# Altium schematic sheet Ethernet_Switch.SchDoc: =project_title
size Tabloid; CompanyName: Luxonis Holding; DrawnBy: Dan Dunga; Organization: Luxonis Holding; Address1: 1925 Harmony Park Drive; Address2: Westminster, CO; Address3: 80234; Address4: United States; SheetNumber: 7; SheetTotal: 16
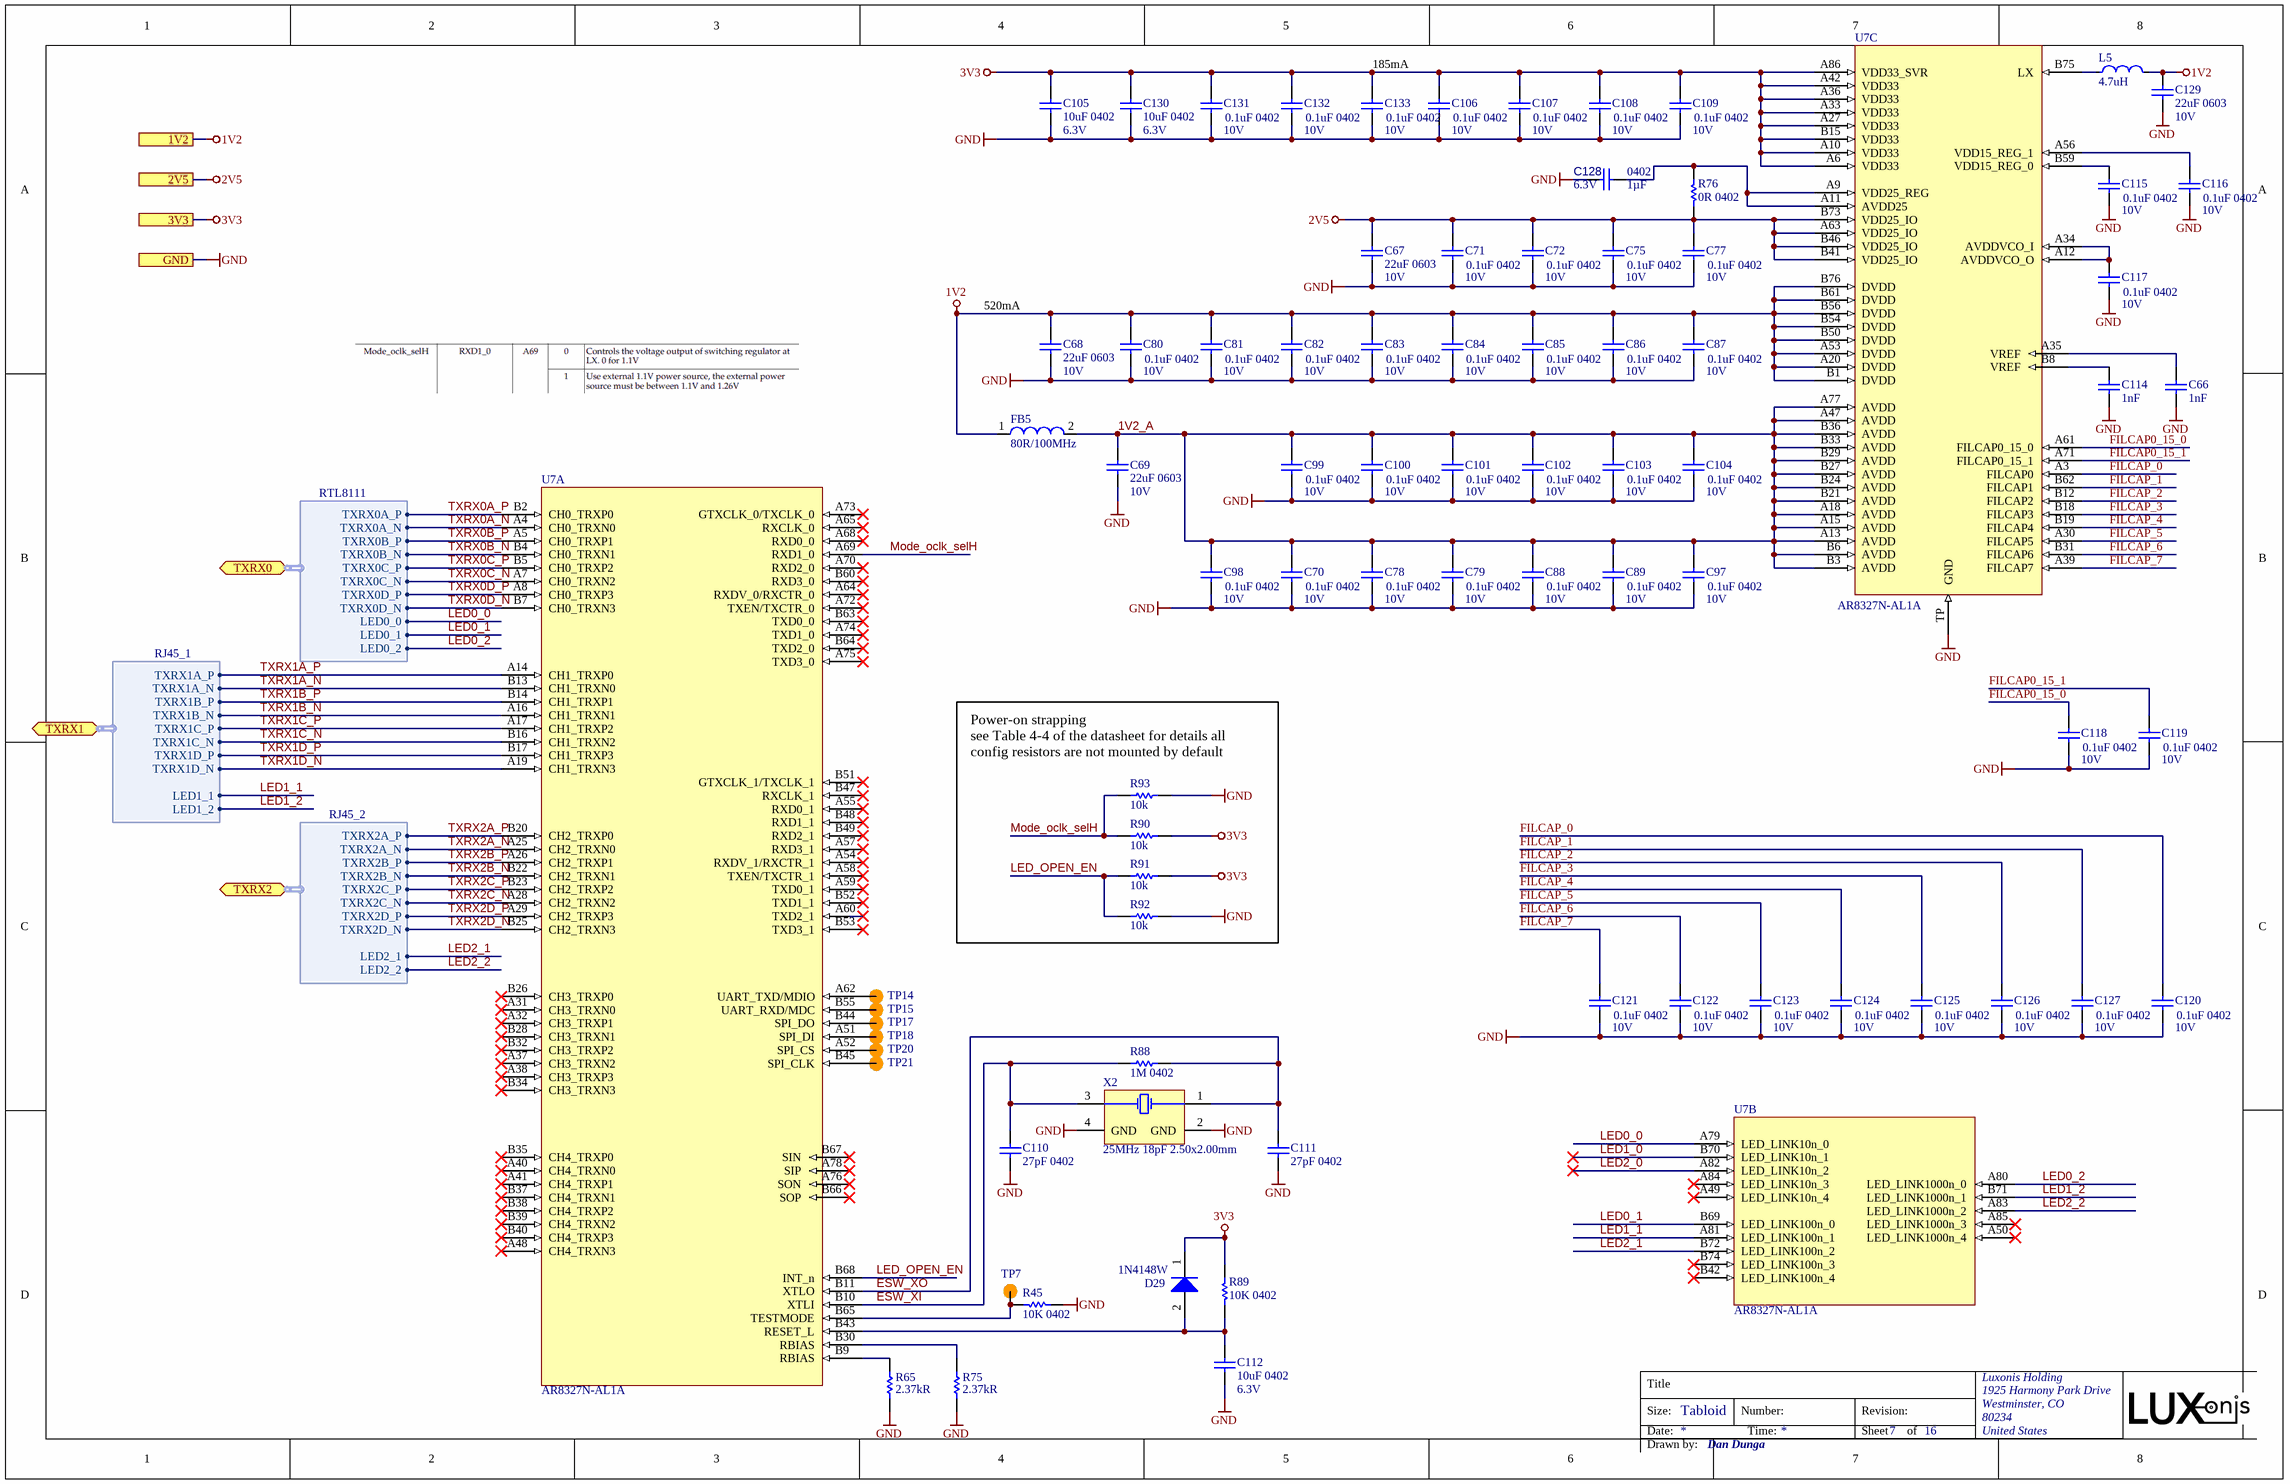
[diagram p0: Ethernet_Switch.SchDoc]

## Parts
C66  value 1nF  [FP-GRM155-0_05-IPC_B]  (hidden comment: GRM1555C1H102JA01D)
C67  22uF 0603  Voltage Rating: 10V  [CAPC0603(1608)100_N]
C68  22uF 0603  Voltage Rating: 10V  [CAPC0603(1608)100_N]
C69  22uF 0603  Voltage Rating: 10V  [CAPC0603(1608)100_N]
C70  0.1uF 0402  Voltage Rating: 10V  [CAPC0402(1005)70_N]
C71  0.1uF 0402  Voltage Rating: 10V  [CAPC0402(1005)70_N]
C72  0.1uF 0402  Voltage Rating: 10V  [CAPC0402(1005)70_N]
C75  0.1uF 0402  Voltage Rating: 10V  [CAPC0402(1005)70_N]
C77  0.1uF 0402  Voltage Rating: 10V  [CAPC0402(1005)70_N]
C78  0.1uF 0402  Voltage Rating: 10V  [CAPC0402(1005)70_N]
C79  0.1uF 0402  Voltage Rating: 10V  [CAPC0402(1005)70_N]
C80  0.1uF 0402  Voltage Rating: 10V  [CAPC0402(1005)70_N]
C81  0.1uF 0402  Voltage Rating: 10V  [CAPC0402(1005)70_N]
C82  0.1uF 0402  Voltage Rating: 10V  [CAPC0402(1005)70_N]
C83  0.1uF 0402  Voltage Rating: 10V  [CAPC0402(1005)70_N]
C84  0.1uF 0402  Voltage Rating: 10V  [CAPC0402(1005)70_N]
C85  0.1uF 0402  Voltage Rating: 10V  [CAPC0402(1005)70_N]
C86  0.1uF 0402  Voltage Rating: 10V  [CAPC0402(1005)70_N]
C87  0.1uF 0402  Voltage Rating: 10V  [CAPC0402(1005)70_N]
C88  0.1uF 0402  Voltage Rating: 10V  [CAPC0402(1005)70_N]
C89  0.1uF 0402  Voltage Rating: 10V  [CAPC0402(1005)70_N]
C97  0.1uF 0402  Voltage Rating: 10V  [CAPC0402(1005)70_N]
C98  0.1uF 0402  Voltage Rating: 10V  [CAPC0402(1005)70_N]
C99  0.1uF 0402  Voltage Rating: 10V  [CAPC0402(1005)70_N]
C100  0.1uF 0402  Voltage Rating: 10V  [CAPC0402(1005)70_N]
C101  0.1uF 0402  Voltage Rating: 10V  [CAPC0402(1005)70_N]
C102  0.1uF 0402  Voltage Rating: 10V  [CAPC0402(1005)70_N]
C103  0.1uF 0402  Voltage Rating: 10V  [CAPC0402(1005)70_N]
C104  0.1uF 0402  Voltage Rating: 10V  [CAPC0402(1005)70_N]
C105  10uF 0402  Voltage Rating: 6.3V  [CAPC0402(1005)70_N]
C106  0.1uF 0402  Voltage Rating: 10V  [CAPC0402(1005)70_N]
C107  0.1uF 0402  Voltage Rating: 10V  [CAPC0402(1005)70_N]
C108  0.1uF 0402  Voltage Rating: 10V  [CAPC0402(1005)70_N]
C109  0.1uF 0402  Voltage Rating: 10V  [CAPC0402(1005)70_N]
C110  27pF 0402  [CAPC0402(1005)60_N]
C111  27pF 0402  [CAPC0402(1005)60_N]
C112  10uF 0402  Voltage Rating: 6.3V  [CAPC0402(1005)70_N]
C114  value 1nF  [FP-GRM155-0_05-IPC_B]  (hidden comment: GRM1555C1H102JA01D)
C115  0.1uF 0402  Voltage Rating: 10V  [CAPC0402(1005)70_N]
C116  0.1uF 0402  Voltage Rating: 10V  [CAPC0402(1005)70_N]
C117  0.1uF 0402  Voltage Rating: 10V  [CAPC0402(1005)70_N]
C118  0.1uF 0402  Voltage Rating: 10V  [CAPC0402(1005)70_N]
C119  0.1uF 0402  Voltage Rating: 10V  [CAPC0402(1005)70_N]
C120  0.1uF 0402  Voltage Rating: 10V  [CAPC0402(1005)70_N]
C121  0.1uF 0402  Voltage Rating: 10V  [CAPC0402(1005)70_N]
C122  0.1uF 0402  Voltage Rating: 10V  [CAPC0402(1005)70_N]
C123  0.1uF 0402  Voltage Rating: 10V  [CAPC0402(1005)70_N]
C124  0.1uF 0402  Voltage Rating: 10V  [CAPC0402(1005)70_N]
C125  0.1uF 0402  Voltage Rating: 10V  [CAPC0402(1005)70_N]
C126  0.1uF 0402  Voltage Rating: 10V  [CAPC0402(1005)70_N]
C127  0.1uF 0402  Voltage Rating: 10V  [CAPC0402(1005)70_N]
C128  value 1µF  Case/Package: 0402  Voltage Rating: 6.3V  [CAPC1005X55X25LL05T10]  (hidden comment: 04026D105KAT2A)
C129  22uF 0603  Voltage Rating: 10V  [CAPC0603(1608)100_N]
C130  10uF 0402  Voltage Rating: 6.3V  [CAPC0402(1005)70_N]
C131  0.1uF 0402  Voltage Rating: 10V  [CAPC0402(1005)70_N]
C132  0.1uF 0402  Voltage Rating: 10V  [CAPC0402(1005)70_N]
C133  0.1uF 0402  Voltage Rating: 10V  [CAPC0402(1005)70_N]
D29  1N4148W  [1N4148W-7-F]
FB5  80R/100MHz  [BK1608HS800-T_N]
L5  Inductance: 4.7uH  [FP-DFE252012C-IPC_C]  (hidden comment: DFE252012P-4R7M=P2)
R45  10K 0402  [RESC0402(1005)_N]
R65  Resistance: 2.37kR  [RESC1005X40X25NL05T05]  (hidden comment: ERJ-2RKF2371X)
R75  Resistance: 2.37kR  [RESC1005X40X25NL05T05]  (hidden comment: ERJ-2RKF2371X)
R76  0R 0402  [RESC0402(1005)_N]
R88  1M 0402  [RESC0402(1005)_N]
R89  10K 0402  [RESC0402(1005)_N]
R90  value 10k  [RESC0402(1005)_N]  (hidden comment: RC0402FR-1310KL)
R91  value 10k  [RESC0402(1005)_N]  (hidden comment: RC0402FR-1310KL)
R92  value 10k  [RESC0402(1005)_N]  (hidden comment: RC0402FR-1310KL)
R93  value 10k  [RESC0402(1005)_N]  (hidden comment: RC0402FR-1310KL)
TP7  TP075_150_NS  [TP075_150_NS]  (value not drawn)  (no BOM)
TP14  TP075_150_NS  [TP075_150_NS]  (value not drawn)  (no BOM)
TP15  TP075_150_NS  [TP075_150_NS]  (value not drawn)  (no BOM)
TP17  TP075_150_NS  [TP075_150_NS]  (value not drawn)  (no BOM)
TP18  TP075_150_NS  [TP075_150_NS]  (value not drawn)  (no BOM)
TP20  TP075_150_NS  [TP075_150_NS]  (value not drawn)  (no BOM)
TP21  TP075_150_NS  [TP075_150_NS]  (value not drawn)  (no BOM)
U7  AR8327N-AL1A  [AR8327N-AL1A]  (parts A,B,C of 3)
X2  25MHz 18pF 2.50x2.00mm  [ECS-250-18-36B-CKY-TR]

## Ports
1V2, 2V5, 3V3, GND, TXRX0 (bidir, harness RTL8111), TXRX1 (bidir, harness RJ45_1), TXRX2 (bidir, harness RJ45_2)

## Harnesses
RTL8111: TXRX0A_P, TXRX0A_N, TXRX0B_P, TXRX0B_N, TXRX0C_P, TXRX0C_N, TXRX0D_P, TXRX0D_N, LED0_0, LED0_1, LED0_2
RJ45_1: TXRX1A_P, TXRX1A_N, TXRX1B_P, TXRX1B_N, TXRX1C_P, TXRX1C_N, TXRX1D_P, TXRX1D_N, LED1_1, LED1_2
RJ45_2: TXRX2A_P, TXRX2A_N, TXRX2B_P, TXRX2B_N, TXRX2C_P, TXRX2C_N, TXRX2D_P, TXRX2D_N, LED2_1, LED2_2

## Nets
1V2: C68.2 C80.2 C81.2 C82.2 C83.2 C84.2 C85.2 C86.2 C87.2 C129.2 FB5.1 L5.2 U7.A20(DVDD) U7.A53(DVDD) U7.B1(DVDD) U7.B50(DVDD) U7.B54(DVDD) U7.B56(DVDD) U7.B61(DVDD) U7.B76(DVDD) ; port 1V2
2V5: C67.2 C71.2 C72.2 C75.2 C77.2 R76.1 U7.A63(VDD25_IO) U7.B41(VDD25_IO) U7.B46(VDD25_IO) U7.B73(VDD25_IO) ; port 2V5
3V3: C105.2 C106.2 C107.2 C108.2 C109.2 C130.2 C131.2 C132.2 C133.2 D29.1(K) R89.1 R90.2 R91.2 U7.A6(VDD33) U7.A10(VDD33) U7.A27(VDD33) U7.A33(VDD33) U7.A36(VDD33) U7.A42(VDD33) U7.A86(VDD33_SVR) U7.B15(VDD33) ; port 3V3
GND: C66.1 C67.1 C68.1 C69.1 C70.1 C71.1 C72.1 C75.1 C77.1 C78.1 C79.1 C80.1 C81.1 C82.1 C83.1 C84.1 C85.1 C86.1 C87.1 C88.1 C89.1 C97.1 C98.1 C99.1 C100.1 C101.1 C102.1 C103.1 C104.1 C105.1 C106.1 C107.1 C108.1 C109.1 C110.1 C111.1 C112.1 C114.1 C115.1 C116.1 C117.1 C118.1 C119.1 C120.1 C121.1 C122.1 C123.1 C124.1 C125.1 C126.1 C127.1 C128.2 C129.1 C130.1 C131.1 C132.1 C133.1 R45.1 R65.1 R75.1 R92.2 R93.2 U7.TP(GND) X2.2(GND) X2.4(GND) ; port GND
1V2_A: C69.2 C70.2 C78.2 C79.2 C88.2 C89.2 C97.2 C98.2 C99.2 C100.2 C101.2 C102.2 C103.2 C104.2 FB5.2 U7.A13(AVDD) U7.A15(AVDD) U7.A18(AVDD) U7.A47(AVDD) U7.A77(AVDD) U7.B3(AVDD) U7.B6(AVDD) U7.B21(AVDD) U7.B24(AVDD) U7.B27(AVDD) U7.B29(AVDD) U7.B33(AVDD) U7.B36(AVDD)
ESW_XI: C110.2 R88.1 U7.B10(XTLI) X2.3(X2)
ESW_XO: C111.2 R88.2 U7.B11(XTLO) X2.1(X1)
FILCAP0_15_0: C118.2 U7.A61(FILCAP0_15_0)
FILCAP0_15_1: C119.2 U7.A71(FILCAP0_15_1)
FILCAP_0: C120.2 U7.A3(FILCAP0)
FILCAP_1: C127.2 U7.B62(FILCAP1)
FILCAP_2: C126.2 U7.B12(FILCAP2)
FILCAP_3: C125.2 U7.B18(FILCAP3)
FILCAP_4: C124.2 U7.B19(FILCAP4)
FILCAP_5: C123.2 U7.A30(FILCAP5)
FILCAP_6: C122.2 U7.B31(FILCAP6)
FILCAP_7: C121.2 U7.A39(FILCAP7)
LED0_0: U7.A79(LED_LINK10n_0) ; port TXRX0.LED0_0
LED0_1: U7.B69(LED_LINK100n_0) ; port TXRX0.LED0_1
LED0_2: U7.A80(LED_LINK1000n_0) ; port TXRX0.LED0_2
LED1_0: U7.B70(LED_LINK10n_1)
LED1_1: U7.A81(LED_LINK100n_1) ; port TXRX1.LED1_1
LED1_2: U7.B71(LED_LINK1000n_1) ; port TXRX1.LED1_2
LED2_0: U7.A82(LED_LINK10n_2)
LED2_1: U7.B72(LED_LINK100n_2) ; port TXRX2.LED2_1
LED2_2: U7.A83(LED_LINK1000n_2) ; port TXRX2.LED2_2
LED_OPEN_EN: R91.1 R92.1 U7.B68(INT_n)
Mode_oclk_selH: R90.1 R93.1 U7.A69(RXD1_0)
TXRX0A_N: U7.A4(CH0_TRXN0) ; port TXRX0.TXRX0A_N
TXRX0A_P: U7.B2(CH0_TRXP0) ; port TXRX0.TXRX0A_P
TXRX0B_N: U7.B4(CH0_TRXN1) ; port TXRX0.TXRX0B_N
TXRX0B_P: U7.A5(CH0_TRXP1) ; port TXRX0.TXRX0B_P
TXRX0C_N: U7.A7(CH0_TRXN2) ; port TXRX0.TXRX0C_N
TXRX0C_P: U7.B5(CH0_TRXP2) ; port TXRX0.TXRX0C_P
TXRX0D_N: U7.B7(CH0_TRXN3) ; port TXRX0.TXRX0D_N
TXRX0D_P: U7.A8(CH0_TRXP3) ; port TXRX0.TXRX0D_P
TXRX1A_N: U7.B13(CH1_TRXN0) ; port TXRX1.TXRX1A_N
TXRX1A_P: U7.A14(CH1_TRXP0) ; port TXRX1.TXRX1A_P
TXRX1B_N: U7.A16(CH1_TRXN1) ; port TXRX1.TXRX1B_N
TXRX1B_P: U7.B14(CH1_TRXP1) ; port TXRX1.TXRX1B_P
TXRX1C_N: U7.B16(CH1_TRXN2) ; port TXRX1.TXRX1C_N
TXRX1C_P: U7.A17(CH1_TRXP2) ; port TXRX1.TXRX1C_P
TXRX1D_N: U7.A19(CH1_TRXN3) ; port TXRX1.TXRX1D_N
TXRX1D_P: U7.B17(CH1_TRXP3) ; port TXRX1.TXRX1D_P
TXRX2A_N: U7.A25(CH2_TRXN0) ; port TXRX2.TXRX2A_N
TXRX2A_P: U7.B20(CH2_TRXP0) ; port TXRX2.TXRX2A_P
TXRX2B_N: U7.B22(CH2_TRXN1) ; port TXRX2.TXRX2B_N
TXRX2B_P: U7.A26(CH2_TRXP1) ; port TXRX2.TXRX2B_P
TXRX2C_N: U7.A28(CH2_TRXN2) ; port TXRX2.TXRX2C_N
TXRX2C_P: U7.B23(CH2_TRXP2) ; port TXRX2.TXRX2C_P
TXRX2D_N: U7.B25(CH2_TRXN3) ; port TXRX2.TXRX2D_N
TXRX2D_P: U7.A29(CH2_TRXP3) ; port TXRX2.TXRX2D_P
NetC66_2: C66.2 U7.A35(VREF)
NetC112_2: C112.2 D29.2(A) R89.2 U7.B43(RESET_L)
NetC114_2: C114.2 U7.B8(VREF)
NetC115_2: C115.2 U7.B59(VDD15_REG_0)
NetC116_2: C116.2 U7.A56(VDD15_REG_1)
NetC117_2: C117.2 U7.A12(AVDDVCO_O) U7.A34(AVDDVCO_I)
NetC128_1: C128.1 R76.2 U7.A9(VDD25_REG) U7.A11(AVDD25)
NetL5_1: L5.1 U7.B75(LX)
NetR45_2: R45.2 TP7.1 U7.B65(TESTMODE)
NetR65_2: R65.2 U7.B9(RBIAS)
NetR75_2: R75.2 U7.B30(RBIAS)
NetTP14_1: TP14.1 U7.A62(UART_TXD/MDIO)
NetTP15_1: TP15.1 U7.B55(UART_RXD/MDC)
NetTP17_1: TP17.1 U7.B44(SPI_DO)
NetTP18_1: TP18.1 U7.A51(SPI_DI)
NetTP20_1: TP20.1 U7.A52(SPI_CS)
NetTP21_1: TP21.1 U7.B45(SPI_CLK)

Not connected (* = marked no-connect by the designer): U7 A31(CH3_TRXN0)* A32(CH3_TRXP1)* A37(CH3_TRXN2)* A38(CH3_TRXP3)* A40(CH4_TRXN0)* A41(CH4_TRXP1)* A48(CH4_TRXN3)* A49(LED_LINK10n_4)* A50(LED_LINK1000n_4)* A54(RXDV_1/RXCTR_1)* A55(RXD0_1)* A57(RXD3_1)* A58(TXEN/TXCTR_1)* A59(TXD0_1)* A60(TXD2_1)* A64(RXDV_0/RXCTR_0)* A65(RXCLK_0)* A68(RXD0_0)* A70(RXD2_0)* A72(TXEN/TXCTR_0)* A73(GTXCLK_0/TXCLK_0)* A74(TXD1_0)* A75(TXD3_0)* A76(SON)* A78(SIP)* A84(LED_LINK10n_3)* A85(LED_LINK1000n_3)* B26(CH3_TRXP0)* B28(CH3_TRXN1)* B32(CH3_TRXP2)* B34(CH3_TRXN3)* B35(CH4_TRXP0)* B37(CH4_TRXN1)* B38(CH4_TRXP2)* B39(CH4_TRXN2)* B40(CH4_TRXP3)* B42(LED_LINK100n_4)* B47(RXCLK_1)* B48(RXD1_1)* B49(RXD2_1)* B51(GTXCLK_1/TXCLK_1)* B52(TXD1_1)* B53(TXD3_1)* B60(RXD3_0)* B63(TXD0_0)* B64(TXD2_0)* B66(SOP)* B67(SIN)* B74(LED_LINK100n_3)*

## Notes on the sheet
- (near C133) 185mA
- (near C68) 520mA
- (near R93) Power-on strapping
  see Table 4-4 of the datasheet for details all config resistors are not mounted by default
- Title
- Size:
- Date:
- Tabloid
- Number:
- Time:
- Revision:
- Sheet
- of
- Drawn by:

## Library data of the parts
C66 C114 = CMP-001-00088-3: 0402 1000 pF 50 V ±5% Tolerance C0G Multilayer Ceramic Chip Capacitor; Manufacturer 1: Murata; Voltage Rating: 50V; Supplier 1: Digikey; Dielectric: C0G; Capacitance: 1nF; Supplier Part Number 1: 490-3244-2-ND; Manufacturer Part Number 1: GRM1555C1H102JA01D; Tolerance: 5%; Case/Package: 0402
C67-C69 C129 = GRM188R61A226ME15D: CAP CER 22UF 10V X5R 0603 20%; Manufacturer 1: Murata; Material: Ceramic; ComponentLink1URL: https://datasheet.ciiva.com/46444/1769893-46444975.pdf?src-supplier=Element14; ComponentLink1Description: https://datasheet.ciiva.com/46444/1769893-46444975.pdf?src-supplier=Element14; Supplier 1: Digi-Key; Manufacturer Part Number 1: GRM188R61A226ME15D; Stock 1: 984716; Pricing 1: 1=0.31000, 10=0.21500, 100=0.12160, 500=0.08584, 1000=0.07512 (USD); RoHS: Yes; Mount: Surface Mount; Case/Package: 0603; Weight: 0.000222oz; Case Code (Metric): 1608; Case Code (Imperial): 0603; Min Operating Temperature: -55°C; Max Operating Temperature: 85°C; Capacitance: 22uF; Tolerance: 20%; Packaging: Tape and Reel; Dielectric: X5R; Voltage Rating (DC): 10V; Termination: SMD/SMT; Package Quantity: 4000; Length: 1.6mm; Height: 0.8mm; Width: 0.8mm; Thickness: 0.039inch; Depth: 0.8mm; REACH SVHC: No SVHC; Lead Free: Lead Free; Supplier Part Number 1: 490-10476-1-ND
C70-C72 C75 C77-C89 C97-C104 C106-C109 C115-C127 C131-C133 = GRM155R71A104JA01D: CAP CER 0.1UF 10V X7R 0402 5%; Manufacturer 1: Murata; Capacitance: 100nF; Supplier 1: Digi-Key; Manufacturer Part Number 1: GRM155R71A104JA01D; Stock 1: 1346709; Pricing 1: 1=0.10000, 10=0.02500, 100=0.01130, 500=0.00806, 1000=0.00633, 2500=0.00575, 5000=0.00529 (USD); RoHS: Yes; Mount: Surface Mount; Case/Package: 0402; Case Code (Imperial): 0402; Case Code (Metric): 1005; Min Operating Temperature: -55°C; Max Operating Temperature: 125°C; Tolerance: 5%; Packaging: Tape and Reel; Voltage Rating (DC): 10V; Dielectric: X7R; Package Quantity: 10000; Termination: SMD/SMT; Length: 1mm; Height: 0.5mm; Width: 0.02inch; Thickness: 0.022inch; Depth: 0.5mm; Radiation Hardening: No; Lead Free: Lead Free; ComponentLink1URL: https://datasheet.ciiva.com/5411/product-5411135.pdf?src-supplier=Mouser; ComponentLink1Description: https://datasheet.ciiva.com/5411/product-5411135.pdf?src-supplier=Mouser; ComponentLink2URL: https://datasheet.ciiva.com/11618/c02e-11618821.pdf?src-supplier=Avnet; ComponentLink2Description: https://datasheet.ciiva.com/11618/c02e-11618821.pdf?src-supplier=Avnet; Supplier Part Number 1: 490-10777-1-ND
C105 C112 C130 = GRM155R60J106ME15D: CAP CER 10UF 6.3V X5R 0402 20%; Manufacturer 1: Murata; Supplier 1: Digi-Key; Manufacturer Part Number 1: GRM155R60J106ME15D; Stock 1: 1839627; Pricing 1: 1=0.23000, 10=0.15700, 100=0.07950, 500=0.05442, 1000=0.04814, 2500=0.04605, 5000=0.04186 (USD); RoHS: Yes; Mount: Surface Mount; Case/Package: 0402; Case Code (Metric): 1005; Case Code (Imperial): 0402; Min Operating Temperature: -55°C; Max Operating Temperature: 85°C; Packaging: Tape and Reel; Capacitance: 10uF; Dielectric: X5R; Length: 0.039inch; Width: 0.02inch; ComponentLink1URL: https://www.murata.com/~/media/webrenewal/support/library/catalog/products/capacitor/mlcc/c02e.ashx?la=en-us&src-supplier=Digi-Key; ComponentLink1Description: https://www.murata.com/~/media/webrenewal/support/library/catalog/products/capacitor/mlcc/c02e.ashx?la=en-us&src-supplier=Digi-Key; Supplier Part Number 1: 490-13238-1-ND; Voltage Rating (DC): 6.3V; Thickness: 0.026inch; Tolerance: 20%
C110 C111 = C0402C270J5GACTU: CAP CER 27PF 50V C0G/NP0 0402; Manufacturer 1: KEMET; Dielectric Material: Ceramic; Tolerance: 5%; Dielectric: C0G; Temperature Coefficient: 30ppm/°C; Supplier 1: Digi-Key; Manufacturer Part Number 1: C0402C270J5GACTU; RoHS: Yes; Category: Ceramic Capacitors; Stock 1: 1799770; Pricing 1: 1=0.10000, 10=0.03500, 100=0.01580, 500=0.01128, 1000=0.00886, 2500=0.00805, 5000=0.00741 (USD); Mount: Surface Mount,PCB; Case/Package: 0402; Number of Pins: 2; Weight: 2.3E-05oz; Case Code (Metric): 1005; Case Code (Imperial): 0402; Contact Plating: Tin,Matte; Min Operating Temperature: -55°C; Max Operating Temperature: 125°C; Capacitance: 27pF; Packaging: Tape and Reel; Voltage Rating (DC): 50V; Package Quantity: 1; Termination: SMD/SMT; Voltage Rating: 50V; Voltage: 50V; Length: 1mm; Height: 0.5mm; Width: 0.5mm; Depth: 0.5mm; Thickness: 0.022inch; Radiation Hardening: No; Lead Free: Lead Free; REACH SVHC: No SVHC; ComponentLink1URL: https://datasheet.ciiva.com/144/docfinderpartnumber-c0402c270j5gactu-144118.pdf?src-supplier=Digi-Key; ComponentLink1Description: https://datasheet.ciiva.com/144/docfinderpartnumber-c0402c270j5gactu-144118.pdf?src-supplier=Digi-Key; ComponentLink2URL: https://datasheet.ciiva.com/7747/kem-c1003-c0g-smd-7747509.pdf?src-supplier=Element14; ComponentLink2Description: https://datasheet.ciiva.com/7747/kem-c1003-c0g-smd-7747509.pdf?src-supplier=Element14; ComponentLink3URL: https://datasheet.ciiva.com/26847/getdatasheetpartid-408632-26847386.pdf?src-supplier=Verical; ComponentLink3Description: https://datasheet.ciiva.com/26847/getdatasheetpartid-408632-26847386.pdf?src-supplier=Verical; ComponentLink4URL: https://datasheet.ciiva.com/7392/1372242-7392237.pdf?src-supplier=Newark; ComponentLink4Description: https://datasheet.ciiva.com/7392/1372242-7392237.pdf?src-supplier=Newark; ComponentLink5URL: https://datasheet.ciiva.com/14586/70095383-14586671.pdf?src-supplier=Allied+Electronics; ComponentLink5Description: https://datasheet.ciiva.com/14586/70095383-14586671.pdf?src-supplier=Allied+Electronics; Supplier 2: Newark; Supplier 3: Mouser; Supplier Part Number 1: 399-1016-1-ND; Supplier Part Number 2: 53M7161; Supplier Part Number 3: 80-C0402C270J5G
C128 = CMP-001-00008-16: CAP CER 1UF 6.3V X5R 0402 10%; Manufacturer 1: AVX; Capacitor Type: Ceramic; Manufacturer Part Number 1: 04026D105KAT2A; Min Operating Temperature: -55°C; Max Operating Temperature: 85°C; Tolerance: 10%; Dielectric: X5R; Mounting Technology: SMT
D29 = 1N4148W-7-F: DIODE GEN PURP 100V 300MA SOD123; Manufacturer 1: Diodes; Element Configuration: Single; Forward Current: 150mA; Forward Voltage: 1.25V; Reverse Recovery Time: 4ns; Peak Non-Repetitive Surge Current: 2A; Peak Reverse Current: 1uA; Power Dissipation: 400mW; Polarity: Standard; Voltage Rating (DC): 75V; Capacitance: 2pF; Current: 15A; Supplier 1: Digi-Key; Manufacturer Part Number 1: 1N4148W-7-F; Stock 1: 5430248; Pricing 1: 1=0.16000, 10=0.15000, 100=0.06290, 500=0.04942, 1000=0.03432 (USD); RoHS: Yes; Mount: Surface Mount; Number of Pins: 2; Weight: 0.000353oz; Contact Plating: Tin,Matte; Min Operating Temperature: -65°C; Max Operating Temperature: 150°C; Packaging: Tape and Reel; Package Quantity: 3000; Max Repetitive Reverse Voltage (Vrrm): 100V; Recovery Time: 4ns; Average Rectified Current: 300mA; Max Reverse Voltage (DC): 100V; Max Surge Current: 2A; Max Forward Surge Current (Ifsm): 2A; Power Rating: 400mW; Current Rating: 150mA; Output Current: 150mA; Voltage: 100V; Length: 2.85mm; Height: 1.25mm; Width: 1.7mm; Radiation Hardening: No; Lead Free: Lead Free; REACH SVHC: No SVHC; ComponentLink1URL: https://datasheet.ciiva.com/4435/ds30086-4435128.pdf?src-supplier=Mouser; ComponentLink1Description: https://datasheet.ciiva.com/4435/ds30086-4435128.pdf?src-supplier=Mouser; ComponentLink2URL: https://datasheet.ciiva.com/8300/ds30086-8300392.pdf?src-supplier=Avnet; ComponentLink2Description: https://datasheet.ciiva.com/8300/ds30086-8300392.pdf?src-supplier=Avnet; ComponentLink3URL: https://datasheet.ciiva.com/911/ds30086-911734.pdf?src-supplier=Digi-Key; ComponentLink3Description: https://datasheet.ciiva.com/911/ds30086-911734.pdf?src-supplier=Digi-Key; ComponentLink4URL: https://datasheet.ciiva.com/911/ds30086-911735.pdf?src-supplier=Digi-Key; ComponentLink4Description: https://datasheet.ciiva.com/911/ds30086-911735.pdf?src-supplier=Digi-Key; ComponentLink5URL: https://datasheet.ciiva.com/22695/1915529-22695239.pdf?src-supplier=Element14; ComponentLink5Description: https://datasheet.ciiva.com/22695/1915529-22695239.pdf?src-supplier=Element14; ComponentLink6URL: https://datasheet.ciiva.com/911/ds30086-911736.pdf?src-supplier=Digi-Key; ComponentLink6Description: https://datasheet.ciiva.com/911/ds30086-911736.pdf?src-supplier=Digi-Key; ComponentLink7URL: https://datasheet.ciiva.com/1179/1915529-1179304.pdf?src-supplier=Element14; ComponentLink7Description: https://datasheet.ciiva.com/1179/1915529-1179304.pdf?src-supplier=Element14; ComponentLink8URL: https://datasheet.ciiva.com/25919/ds30086-25919609.pdf?src-supplier=Avnet+Europe; ComponentLink8Description: https://datasheet.ciiva.com/25919/ds30086-25919609.pdf?src-supplier=Avnet+Europe; ComponentLink9URL: https://datasheet.ciiva.com/15219/getdatasheetpartid-110030-15219548.pdf?src-supplier=Verical; ComponentLink9Description: https://datasheet.ciiva.com/15219/getdatasheetpartid-110030-15219548.pdf?src-supplier=Verical; ComponentLink10URL: https://datasheet.ciiva.com/8303/ds30086-8303197.pdf?src-supplier=Avnet; ComponentLink10Description: https://datasheet.ciiva.com/8303/ds30086-8303197.pdf?src-supplier=Avnet; Supplier 2: Newark; Supplier 3: Mouser; Supplier Part Number 1: 1N4148W-FDICT-ND; Supplier Part Number 2: 52R3924; Supplier Part Number 3: 621-1N4148W-F
FB5 = BK1608HS800-T: FERRITE BEAD 80 OHM 0603 1LN; Manufacturer 1: Taiyo Yuden; Impedance: 80R; Tolerance: 25%; Max DC Current: 600mA; DC Resistance (DCR): 100mR; Test Frequency: 100MHz; Number of Lines: 1; Shielding: Shielded; Supplier 1: Digi-Key; Manufacturer Part Number 1: BK1608HS800-T; Stock 1: 6285; Pricing 1: 1=0.10000, 10=0.07900, 25=0.07200, 50=0.06480, 100=0.04760, 250=0.03460, 500=0.03170, 1000=0.02738 (USD); RoHS: Yes; Mount: Surface Mount; Case/Package: 0603; Number of Pins: 2; Core Material: Ferrite; Case Code (Metric): 1608; Case Code (Imperial): 0603; Min Operating Temperature: -55°C; Max Operating Temperature: 125°C; Package Quantity: 1; Packaging: Tape and Reel; Termination: SMD/SMT; Max Current Rating: 600mA; Frequency: 100MHz; Length: 0.063inch; Height: 0.037inch; Width: 0.8mm; Depth: 0.95mm; REACH SVHC: Unknown; Lead Free: Lead Free; Halogen Free: Halogen Free; ComponentLink1URL: https://datasheet.ciiva.com/1011/bk1608hs800-t-ss-1011885.pdf?src-supplier=Digi-Key; ComponentLink1Description: https://datasheet.ciiva.com/1011/bk1608hs800-t-ss-1011885.pdf?src-supplier=Digi-Key; ComponentLink2URL: https://datasheet.ciiva.com/1011/mlci07-e-1011886.pdf?src-supplier=Digi-Key; ComponentLink2Description: https://datasheet.ciiva.com/1011/mlci07-e-1011886.pdf?src-supplier=Digi-Key; ComponentLink3URL: https://datasheet.ciiva.com/1011/mlci07-e-1011887.pdf?src-supplier=Digi-Key; ComponentLink3Description: https://datasheet.ciiva.com/1011/mlci07-e-1011887.pdf?src-supplier=Digi-Key; Supplier 2: Mouser; Supplier 3: Arrow; Supplier Part Number 1: 587-1875-1-ND; Supplier Part Number 2: 963-BK1608HS800-T; Supplier Part Number 3: BK1608HS800-T
L5 = CMP-006-00022-1: Inductor Power Shielded Wirewound 4.7uH 20% 1MHz Metal 1.4A 0.2Ohm DCR 1008 T/R; Manufacturer 1: Murata; Core Material: Ferrite; DC Resistance (DCR): 200mR; Current Rating: 2A; Case/Package: 1008; Supplier 1: Digikey; Supplier Part Number 1: 490-10651-2-ND; Manufacturer Part Number 1: DFE252012P-4R7M=P2; Max DC Current: 1.4A
R45 R89 = RC0402FR-1310KL: RES SMD 10K OHM 1% 0402 1/16W Chip Resistor, 0402 [1005 Metric], 10 kohm, RC Series, 50 V, Thick Film, 62.5 mW; Manufacturer 1: Yageo; Resistance: 10kR; Temperature Coefficient: 100ppm/°C; Power Rating: 62.5mW; Voltage Rating: 50V; ComponentLink1URL: https://datasheet.ciiva.com/16940/pyu-rc0402-51-rohs-l-6-16940293.pdf?src-supplier=Avnet+Europe; ComponentLink1Description: https://datasheet.ciiva.com/16940/pyu-rc0402-51-rohs-l-6-16940293.pdf?src-supplier=Avnet+Europe; ComponentLink2URL: https://datasheet.ciiva.com/28386/pyu-rc0402-51-rohs-l-6-28386855.pdf?src-supplier=Avnet+Europe; ComponentLink2Description: https://datasheet.ciiva.com/28386/pyu-rc0402-51-rohs-l-6-28386855.pdf?src-supplier=Avnet+Europe; ComponentLink3URL: https://datasheet.ciiva.com/16740/pyu-rc0402-51-rohs-l-6-r-16740602.pdf?src-supplier=Future+Electronics; ComponentLink3Description: https://datasheet.ciiva.com/16740/pyu-rc0402-51-rohs-l-6-r-16740602.pdf?src-supplier=Future+Electronics; ComponentLink4URL: https://datasheet.ciiva.com/8891/pyu-rc0402-51-rohs-l-6-8891339.pdf?src-supplier=Avnet; ComponentLink4Description: https://datasheet.ciiva.com/8891/pyu-rc0402-51-rohs-l-6-8891339.pdf?src-supplier=Avnet; ComponentLink5URL: https://datasheet.ciiva.com/5557/pyu-rc0402-51-rohs-l-6-r-5557997.pdf?src-supplier=Mouser; ComponentLink5Description: https://datasheet.ciiva.com/5557/pyu-rc0402-51-rohs-l-6-r-5557997.pdf?src-supplier=Mouser; ComponentLink6URL: https://datasheet.ciiva.com/7983/1018594-7983533.pdf?src-supplier=Element14; ComponentLink6Description: https://datasheet.ciiva.com/7983/1018594-7983533.pdf?src-supplier=Element14; Supplier 1: Newark; Manufacturer Part Number 1: RC0402FR-1310KL; Stock 1: 62239; Pricing 1: 1=0.10000, 25=0.01200, 100=0.00400, 250=0.00400, 500=0.00300, 1000=0.00300 (USD); RoHS: Yes; Case/Package: 0402; Number of Pins: 2; Contact Plating: Tin,Matte,Lead; Case Code (Imperial): 0402; Case Code (Metric): 1005; Min Operating Temperature: -55°C; Max Operating Temperature: 155°C; Tolerance: 1%; Composition: Thick Film; Packaging: Tape and Reel; Termination: SMD/SMT; Military Standard: Not; Voltage Rating (DC): 50V; Working Voltage: 50V; Number of Terminations: 2; Length: 1mm; Depth: 0.5mm; Radiation Hardening: No; REACH SVHC: No SVHC; Lead Free: Lead Free; Supplier Part Number 1: 67R9960
R65 R75 = CMP-009-00184-1: Res Thick Film 0402 2.37K Ohm 1% 1/10W ±100ppm/°C Molded SMD Punched Carrier T/R; Manufacturer 1: Panasonic; Power Rating: 100mW; Case/Package: 0402; Resistor Type: Thick Film; Tolerance: 1%; Supplier Part Number 1: P2.37KLTR-ND; Supplier 1: Digikey; Manufacturer Part Number 1: ERJ-2RKF2371X
R76 = RC0402FR-1310KL: RES SMD 0R OHM 1% 0402 1/16W Chip Resistor, 0402 [1005 Metric], 0 ohm, RC Series, 50 V, Thick Film, 62.5 mW; Manufacturer 1: Yageo; Temperature Coefficient: 100ppm/°C; Power Rating: 62.5mW; Voltage Rating: 50V; ComponentLink1URL: https://datasheet.ciiva.com/16940/pyu-rc0402-51-rohs-l-6-16940293.pdf?src-supplier=Avnet+Europe; ComponentLink1Description: https://datasheet.ciiva.com/16940/pyu-rc0402-51-rohs-l-6-16940293.pdf?src-supplier=Avnet+Europe; ComponentLink2URL: https://datasheet.ciiva.com/28386/pyu-rc0402-51-rohs-l-6-28386855.pdf?src-supplier=Avnet+Europe; ComponentLink2Description: https://datasheet.ciiva.com/28386/pyu-rc0402-51-rohs-l-6-28386855.pdf?src-supplier=Avnet+Europe; ComponentLink3URL: https://datasheet.ciiva.com/16740/pyu-rc0402-51-rohs-l-6-r-16740602.pdf?src-supplier=Future+Electronics; ComponentLink3Description: https://datasheet.ciiva.com/16740/pyu-rc0402-51-rohs-l-6-r-16740602.pdf?src-supplier=Future+Electronics; ComponentLink4URL: https://datasheet.ciiva.com/8891/pyu-rc0402-51-rohs-l-6-8891339.pdf?src-supplier=Avnet; ComponentLink4Description: https://datasheet.ciiva.com/8891/pyu-rc0402-51-rohs-l-6-8891339.pdf?src-supplier=Avnet; ComponentLink5URL: https://datasheet.ciiva.com/5557/pyu-rc0402-51-rohs-l-6-r-5557997.pdf?src-supplier=Mouser; ComponentLink5Description: https://datasheet.ciiva.com/5557/pyu-rc0402-51-rohs-l-6-r-5557997.pdf?src-supplier=Mouser; ComponentLink6URL: https://datasheet.ciiva.com/7983/1018594-7983533.pdf?src-supplier=Element14; ComponentLink6Description: https://datasheet.ciiva.com/7983/1018594-7983533.pdf?src-supplier=Element14; Supplier 1: Newark; Manufacturer Part Number 1: RC0402FR-1310KL; Stock 1: 62239; Pricing 1: 1=0.10000, 25=0.01200, 100=0.00400, 250=0.00400, 500=0.00300, 1000=0.00300 (USD); RoHS: Yes; Case/Package: 0402; Number of Pins: 2; Contact Plating: Tin,Matte,Lead; Case Code (Imperial): 0402; Case Code (Metric): 1005; Min Operating Temperature: -55°C; Max Operating Temperature: 155°C; Tolerance: 1%; Resistance: 0 R; Composition: Thick Film; Packaging: Tape and Reel; Termination: SMD/SMT; Military Standard: Not; Voltage Rating (DC): 50V; Working Voltage: 50V; Number of Terminations: 2; Length: 1mm; Depth: 0.5mm; Radiation Hardening: No; REACH SVHC: No SVHC; Lead Free: Lead Free; Supplier Part Number 1: 67R9960
R88 = RC0402FR-071ML: RES SMD 1M OHM 1% 1/16W 0402; Manufacturer 1: Yageo; Resistance: 1MR; Temperature Coefficient: 100ppm/°C; Power Rating: 63mW; Voltage Rating: 50V; Manufacturer Part Number 1: RC0402FR-071ML; Supplier 1: Digi-Key; Stock 1: 11406681; Pricing 1: 1=0.10000, 10=0.01500, 100=0.00600, 1000=0.00268, 2500=0.00232, 5000=0.00192 (USD); RoHS: Yes; Case/Package: 0402; Case Code (Imperial): 0402; Case Code (Metric): 1005; Min Operating Temperature: -55°C; Max Operating Temperature: 155°C; Packaging: Tape and Reel; Tolerance: 1%; Composition: Thick Film; Military Standard: Not; Termination: SMD/SMT; Length: 1mm; Height: 0.32mm; Depth: 0.5mm; Lead Free: Lead Free; REACH SVHC: Unknown; ComponentLink1URL: https://datasheet.ciiva.com/11808/0900766b80c66297-11808125.pdf?src-supplier=RSComponents; ComponentLink1Description: https://datasheet.ciiva.com/11808/0900766b80c66297-11808125.pdf?src-supplier=RSComponents; ComponentLink2URL: https://datasheet.ciiva.com/46394/1018594-46394951.pdf?src-supplier=Element14; ComponentLink2Description: https://datasheet.ciiva.com/46394/1018594-46394951.pdf?src-supplier=Element14; ComponentLink3URL: https://datasheet.ciiva.com/16741/pyu-rc0402-51-rohs-l-6-r-16741081.pdf?src-supplier=Future+Electronics; ComponentLink3Description: https://datasheet.ciiva.com/16741/pyu-rc0402-51-rohs-l-6-r-16741081.pdf?src-supplier=Future+Electronics; ComponentLink4URL: https://datasheet.ciiva.com/7849/1018594-7849882.pdf?src-supplier=Element14; ComponentLink4Description: https://datasheet.ciiva.com/7849/1018594-7849882.pdf?src-supplier=Element14; ComponentLink5URL: https://datasheet.ciiva.com/7849/1018594-7849883.pdf?src-supplier=Element14; ComponentLink5Description: https://datasheet.ciiva.com/7849/1018594-7849883.pdf?src-supplier=Element14; Supplier Part Number 1: 311-1.00MLRCT-ND; Supplier 2: Mouser; Supplier Part Number 2: 603-RC0402FR-071ML
R90-R93 = CMP-013-000018-2: RES SMD 10K OHM 1% 0402 1/16W Chip Resistor, 0402 [1005 Metric], 10 kohm, RC Series, 50 V, Thick Film, 62.5 mW; Manufacturer 1: Yageo; Temperature Coefficient: 100ppm/°C; Voltage Rating (DC): 50V; Power Rating: 62.5mW; Tolerance: 1%; ComponentLink1URL: https://datasheet.ciiva.com/16940/pyu-rc0402-51-rohs-l-6-16940293.pdf?src-supplier=Avnet+Europe; Composition: Thick Film; ComponentLink6Description: https://datasheet.ciiva.com/7983/1018594-7983533.pdf?src-supplier=Element14; Manufacturer Part Number 1: RC0402FR-1310KL; Pricing 1: 1=0.10000, 25=0.01200, 100=0.00400, 250=0.00400, 500=0.00300, 1000=0.00300 (USD); Source: LuxonisMaster.SchLib; Radiation Hardening: No; ComponentLink4URL: https://datasheet.ciiva.com/8891/pyu-rc0402-51-rohs-l-6-8891339.pdf?src-supplier=Avnet; Contact Plating: Tin,Matte,Lead; Depth: 0.5mm; Stock 1: 62239; Working Voltage: 50V; REACH SVHC: No SVHC; Min Operating Temperature: -55°C; Voltage Rating: 50V; Case/Package: 0402; Lead Free: Lead Free; ComponentLink6URL: https://datasheet.ciiva.com/7983/1018594-7983533.pdf?src-supplier=Element14; ComponentLink5Description: https://datasheet.ciiva.com/5557/pyu-rc0402-51-rohs-l-6-r-5557997.pdf?src-supplier=Mouser; ComponentLink3Description: https://datasheet.ciiva.com/16740/pyu-rc0402-51-rohs-l-6-r-16740602.pdf?src-supplier=Future+Electronics; Number of Pins: 2; ComponentLink4Description: https://datasheet.ciiva.com/8891/pyu-rc0402-51-rohs-l-6-8891339.pdf?src-supplier=Avnet; ComponentLink3URL: https://datasheet.ciiva.com/16740/pyu-rc0402-51-rohs-l-6-r-16740602.pdf?src-supplier=Future+Electronics; Length: 1mm; ComponentLink2URL: https://datasheet.ciiva.com/28386/pyu-rc0402-51-rohs-l-6-28386855.pdf?src-supplier=Avnet+Europe; Military Standard: Not; Packaging: Tape and Reel; ComponentLink5URL: https://datasheet.ciiva.com/5557/pyu-rc0402-51-rohs-l-6-r-5557997.pdf?src-supplier=Mouser; RoHS: Yes; Design Item ID: RC0402FR-1310KL; Case Code (Imperial): 0402; ComponentLink1Description: https://datasheet.ciiva.com/16940/pyu-rc0402-51-rohs-l-6-16940293.pdf?src-supplier=Avnet+Europe; Max Operating Temperature: 155°C; Number of Terminations: 2; Resistance: 10k; Case Code (Metric): 1005; ComponentLink2Description: https://datasheet.ciiva.com/28386/pyu-rc0402-51-rohs-l-6-28386855.pdf?src-supplier=Avnet+Europe; Termination: SMD/SMT
TP7 TP14 TP15 TP17 TP18 TP20 TP21 = TEST_POINT
U7 = AR8327N-AL1A: Seven-port Gigabit Ethernet Switch; Manufacturer 1: Qualcomm Atheros; Manufacturer Part Number 1: AR8327N-AL1A; Supplier 1: KingTop; Supplier Part Number 1: AR8327N-AL1A
X2 = ECS-250-18-36B-CKY-TR: CRYSTAL 25.0000MHZ 18PF SMD 25MHz ±10ppm Crystal 18pF 50 Ohms 4-SMD, No Lead; Manufacturer 1: ECS International; Supplier 1: Digi-Key; Manufacturer Part Number 1: ECS-250-18-36B-CKY-TR; RoHS: No; Stock 1: 1111; Pricing 1: 1=0.48000, 10=0.39900, 50=0.35880, 100=0.31900, 500=0.30306 (USD); Supplier 2: Mouser; Supplier 3: Arrow; Supplier Part Number 1: XC3051CT-ND; Supplier Part Number 2: 520-250-18-36B-CKYT; Supplier Part Number 3: ECS-250-18-36B-CKY-TR